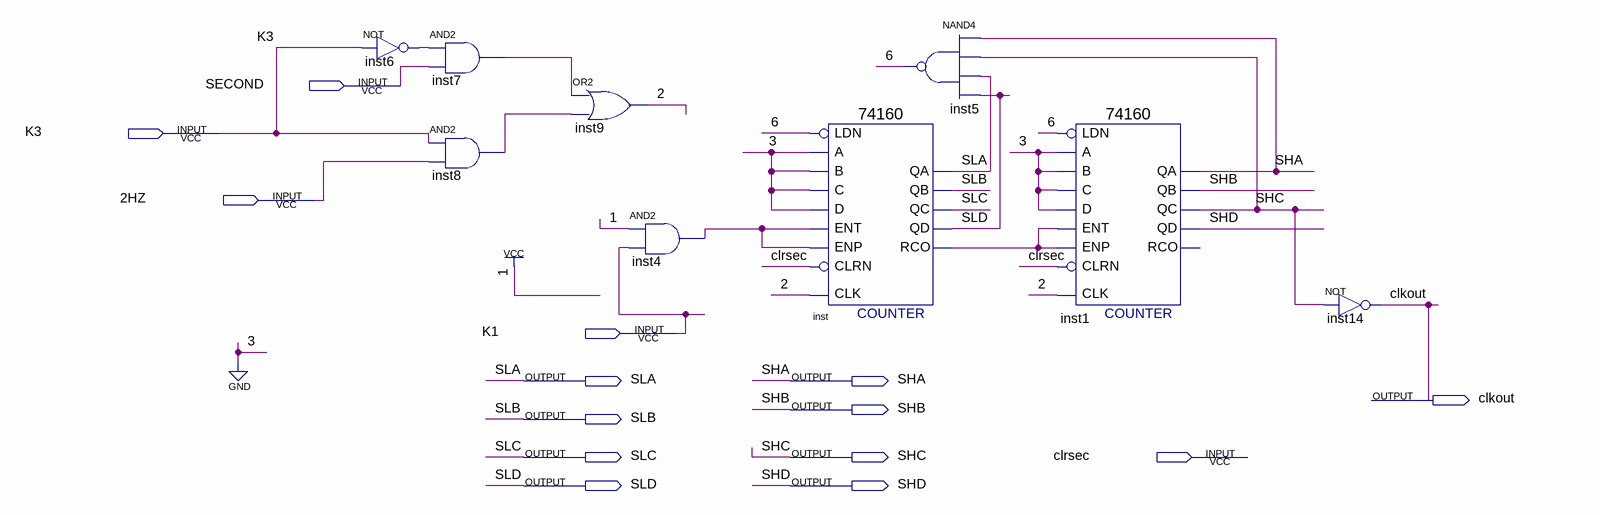
[diagram p0: schematic sheet]
// Quartus schematic MINUTE.bdf as structural Verilog: 9 symbols, 14 pins
module MINUTE (
  input  SECOND,
  input  K3,
  input  \2HZ ,
  input  K1,
  input  clrsec,
  output SLA,
  output SHA,
  output clkout,
  output SHB,
  output SLB,
  output SLC,
  output SHC,
  output SLD,
  output SHD
);

  wire \2 , \6 , inst4_out, inst6_out, inst7_out, inst8_out, inst_rco;

  not inst6 (inst6_out, K3);
  and inst7 (inst7_out, inst6_out, SECOND);
  and inst8 (inst8_out, K3, \2HZ );
  or inst9 (\2 , inst7_out, inst8_out);
  and inst4 (inst4_out, 1'b1, K1);
  \74160  inst (
    .CLK(\2 ), .ENT(inst4_out), .A(1'b0), .B(1'b0), .C(1'b0), .D(1'b0), .LDN(\6 ), .ENP(inst4_out),
    .CLRN(clrsec), .QD(SLD), .QA(SLA), .QB(SLB), .QC(SLC), .RCO(inst_rco));
  nand inst5 (\6 , SHA, SHC, SLA, SLD);
  \74160  inst1 (
    .CLK(\2 ), .ENT(inst_rco), .A(1'b0), .B(1'b0), .C(1'b0), .D(1'b0), .LDN(\6 ), .ENP(inst_rco),
    .CLRN(clrsec), .QD(SHD), .QA(SHA), .QB(SHB), .QC(SHC));  // open: RCO
  not inst14 (clkout, SHC);
endmodule
